# EasyEDA schematic SNES Fight.json
TITLE: Sheet_1; REV: 1.0; Date: 2023-01-30; Sheet: 1/1; Company: Your Company
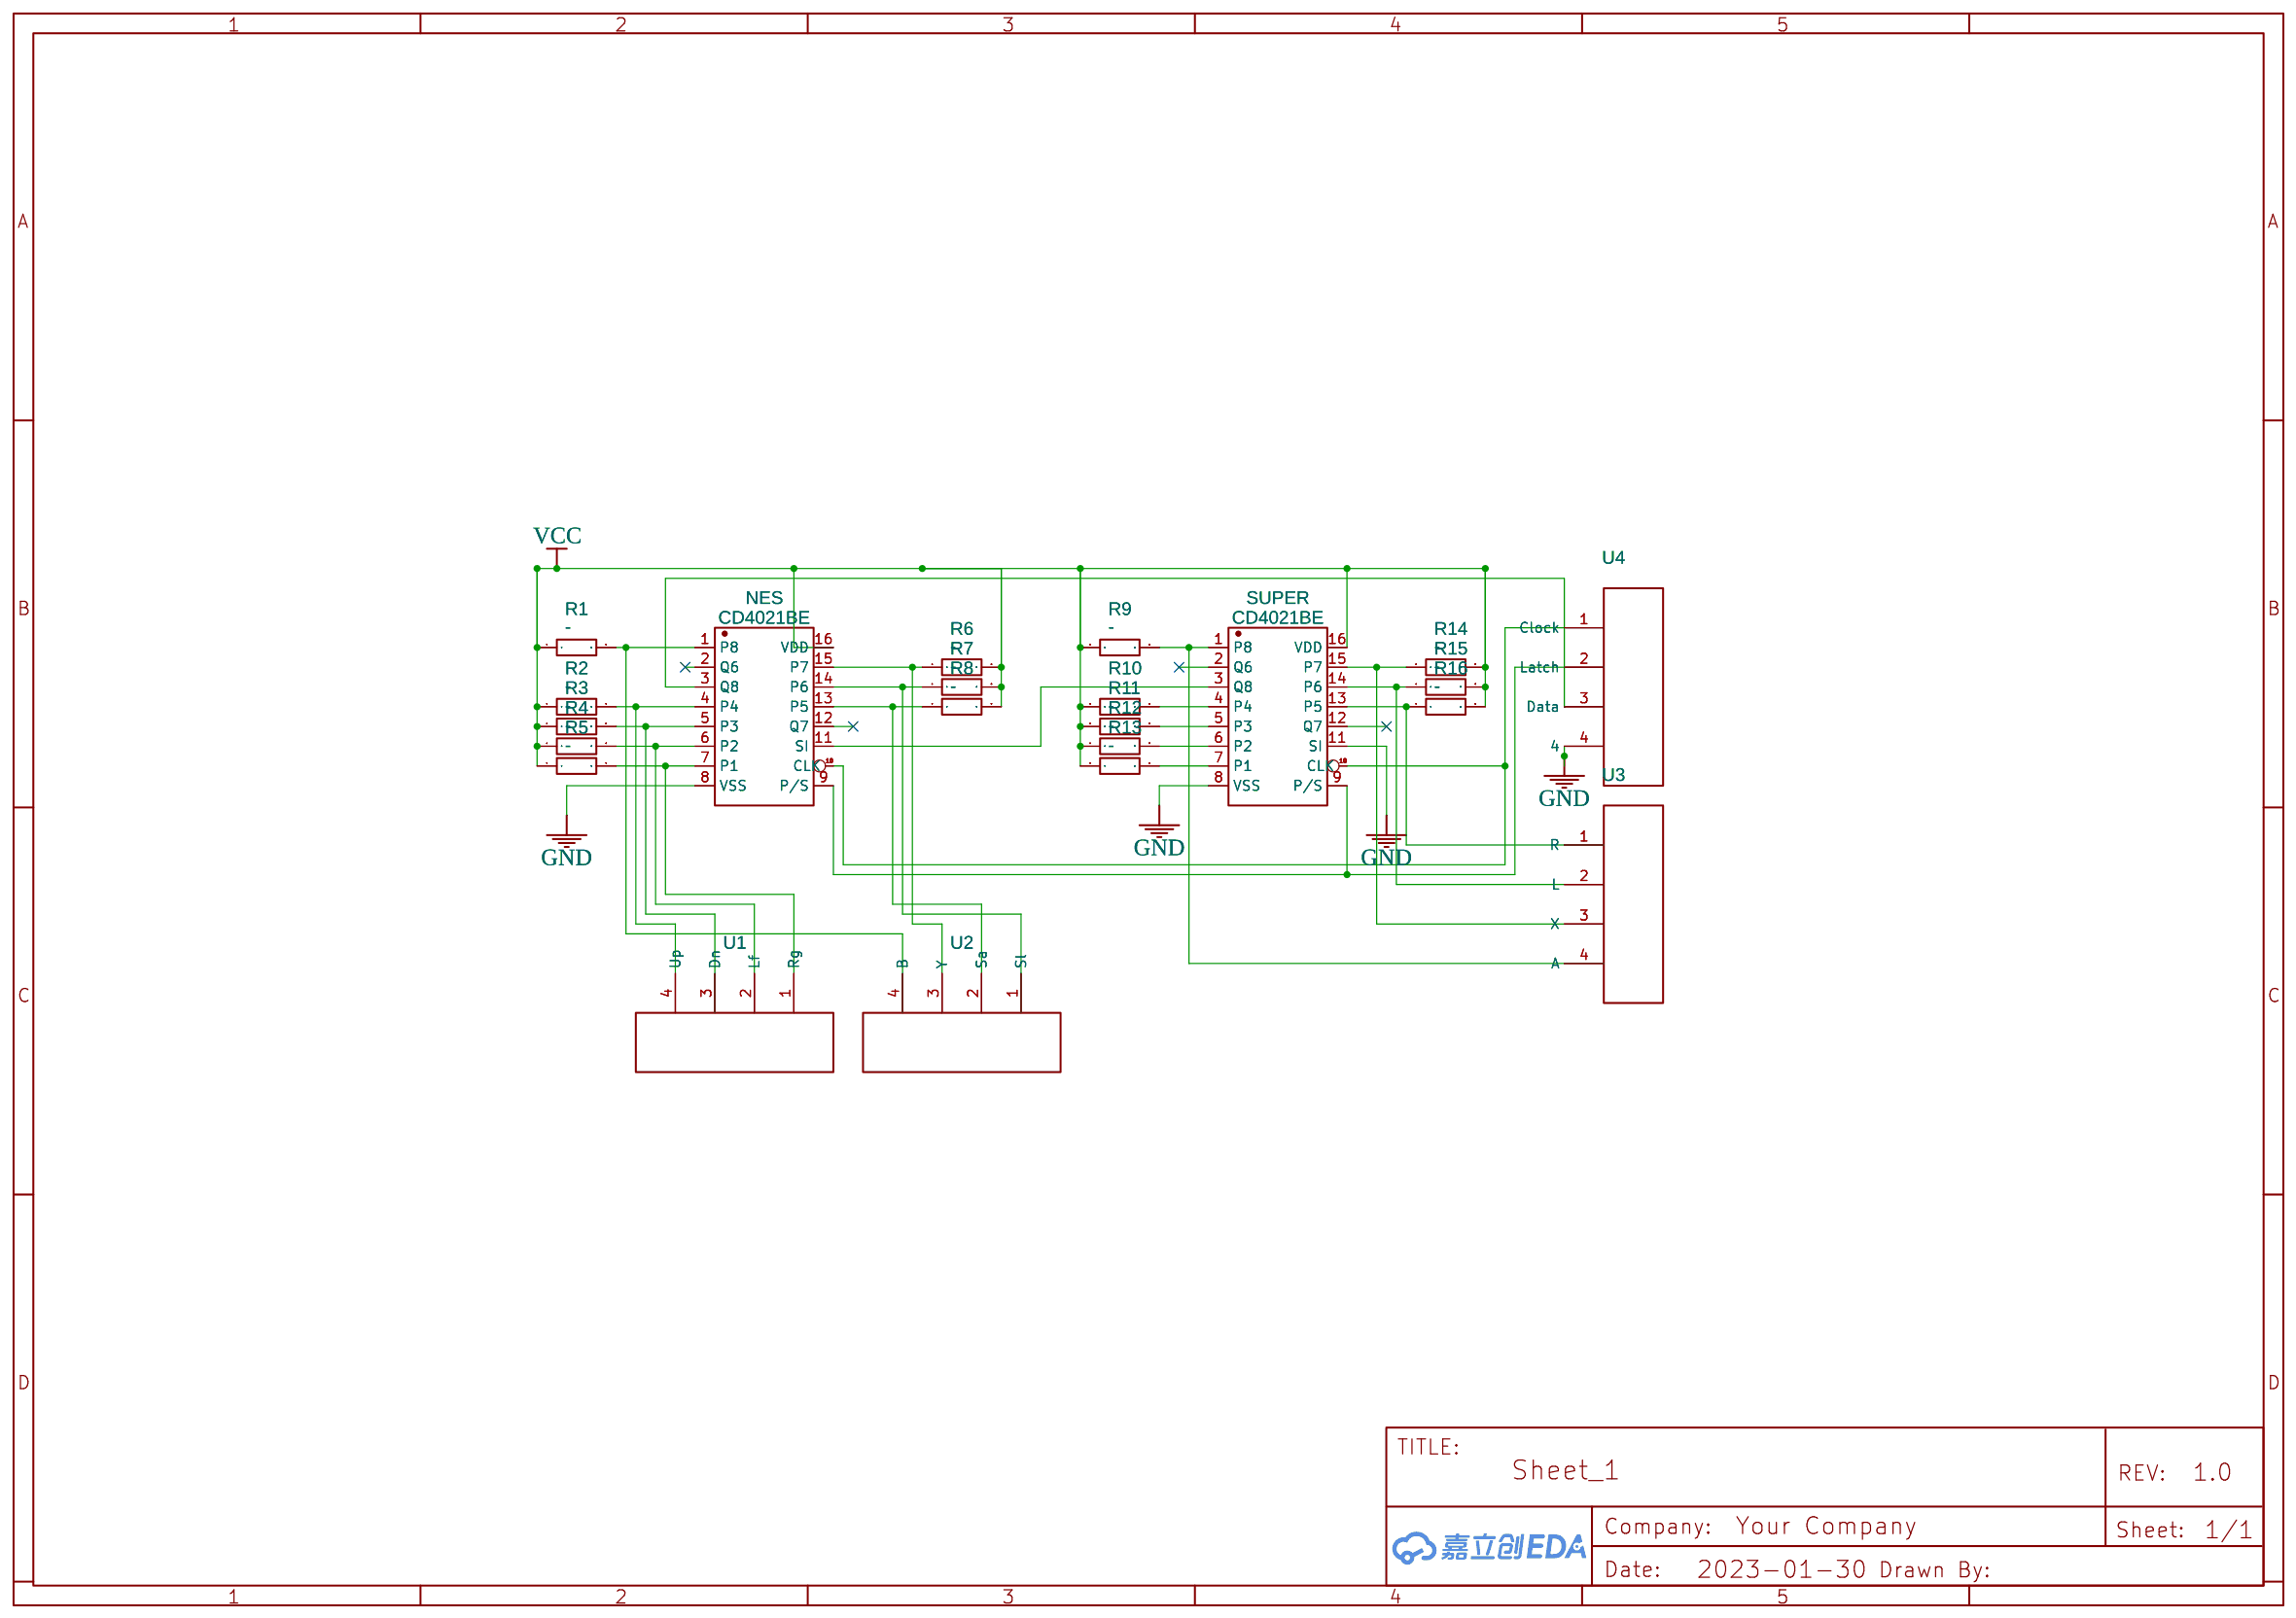
[diagram p0: schematic sheet]

## Parts
NES  CD4021BE  [DIP-16_16P-L20.2-W6.6-P2.54-LS7.6-BL]
R1  -  [RES-TH_BD4.0-L11.5-P15.50-D0.7]
R2  -  [RES-TH_BD4.0-L11.5-P15.50-D0.7]
R3  -  [RES-TH_BD4.0-L11.5-P15.50-D0.7]
R4  -  [RES-TH_BD4.0-L11.5-P15.50-D0.7]
R5  -  [RES-TH_BD4.0-L11.5-P15.50-D0.7]
R6  -  [RES-TH_BD4.0-L11.5-P15.50-D0.7]
R7  -  [RES-TH_BD4.0-L11.5-P15.50-D0.7]
R8  -  [RES-TH_BD4.0-L11.5-P15.50-D0.7]
R9  -  [RES-TH_BD4.0-L11.5-P15.50-D0.7]
R10  -  [RES-TH_BD4.0-L11.5-P15.50-D0.7]
R11  -  [RES-TH_BD4.0-L11.5-P15.50-D0.7]
R12  -  [RES-TH_BD4.0-L11.5-P15.50-D0.7]
R13  -  [RES-TH_BD4.0-L11.5-P15.50-D0.7]
R14  -  [RES-TH_BD4.0-L11.5-P15.50-D0.7]
R15  -  [RES-TH_BD4.0-L11.5-P15.50-D0.7]
R16  -  [RES-TH_BD4.0-L11.5-P15.50-D0.7]
SUPER  CD4021BE  [DIP-16_16P-L20.2-W6.6-P2.54-LS7.6-BL]
U1  4 pin 5mm pitch terminal block  [TERMINAL-BLOCK-4-PIN-3.5MM-ROUND-PAD]
U2  4 pin 5mm pitch terminal block  [TERMINAL-BLOCK-4-PIN-3.5MM-ROUND-PAD]
U3  4 pin 5mm pitch terminal block  [TERMINAL-BLOCK-4-PIN-3.5MM-ROUND-PAD]
U4  4 pin 5mm pitch terminal block  [TERMINAL-BLOCK-4-PIN-3.5MM-ROUND-PAD]

## Library data of the parts
NES SUPER = CD4021BE: Supplier: LCSC; Manufacturer: TI(德州仪器); Contributor: LCSC; Supplier Part: C139390; JLCPCB Part Class: Extended Part
R1-R16 = 1623925-3: Supplier: LCSC; Supplier Part: C306261; Manufacturer: TE Connectivity(美国泰科); Resistance (Ohms): 10K; Contributor: LCSC; JLCPCB Part Class: Extended Part
U1-U4 = 4 pin 5mm pitch terminal block: Manufacturer: Phoenix Contact; Manufacturer Part: 1935187; Supplier: Digi-Key; Supplier Part: 277-1579-ND; link: https://www.digikey.ca/product-detail/en/1935187/277-1579-ND/568616/?itemSeq=314368513; Contributor: Tysoo2

## Nets
GND: NES.8(VSS) SUPER.8(VSS) SUPER.11(SI) U4.4
VCC: NES.16(VDD) R1.1 R2.1 R3.1 R4.1 R5.1 R6.2 R7.2 R8.2 R9.1 R10.1 R11.1 R12.1 R13.1 R14.2 R15.2 R16.2 SUPER.16(VDD)
Net-(NES-1): NES.1(P8) R1.2 U2.4(B)
Net-(NES-3): NES.3(Q8) U4.3(Data)
Net-(NES-4): NES.4(P4) R2.2 U1.4(Up)
Net-(NES-5): NES.5(P3) R3.2 U1.3(Dn)
Net-(NES-6): NES.6(P2) R4.2 U1.2(Lf)
Net-(NES-7): NES.7(P1) R5.2 U1.1(Rg)
Net-(NES-9): NES.9(P/S) SUPER.9(P/S) U4.2(Latch)
Net-(NES-10): NES.10(CLK) SUPER.10(CLK) U4.1(Clock)
Net-(NES-11): NES.11(SI) SUPER.3(Q8)
Net-(NES-13): NES.13(P5) R8.1 U2.2(Sa)
Net-(NES-14): NES.14(P6) R7.1 U2.1(Sl)
Net-(NES-15): NES.15(P7) R6.1 U2.3(Y)
Net-(R9-2): R9.2 SUPER.1(P8) U3.4(A)
Net-(R10-2): R10.2 SUPER.4(P4)
Net-(R11-2): R11.2 SUPER.5(P3)
Net-(R12-2): R12.2 SUPER.6(P2)
Net-(R13-2): R13.2 SUPER.7(P1)
Net-(R14-1): R14.1 SUPER.15(P7) U3.3(X)
Net-(R15-1): R15.1 SUPER.14(P6) U3.2(L)
Net-(R16-1): R16.1 SUPER.13(P5) U3.1(R)

Not connected (* = marked no-connect by the designer): NES 2(Q6) 12(Q7); SUPER 2(Q6) 12(Q7)
